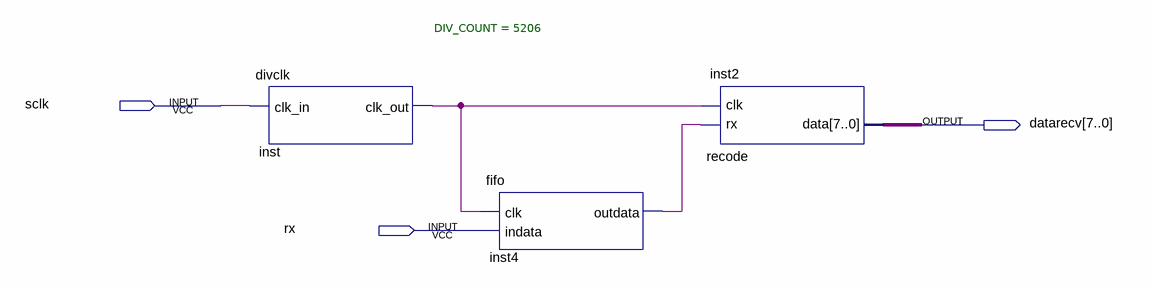
[diagram p0: schematic sheet]
// Quartus schematic uart.bdf as structural Verilog: 3 symbols, 3 pins
module uart (
  input  sclk,
  input  rx,
  output [7:0] datarecv
);

  wire inst4_outdata, inst_clk_out;

  divclk #(.DIV_COUNT(5206)) inst (.clk_in(sclk), .clk_out(inst_clk_out));
  fifo inst4 (.clk(inst_clk_out), .indata(rx), .outdata(inst4_outdata));
  recode inst2 (.rx(inst4_outdata), .clk(inst_clk_out), .data(datarecv));
endmodule
